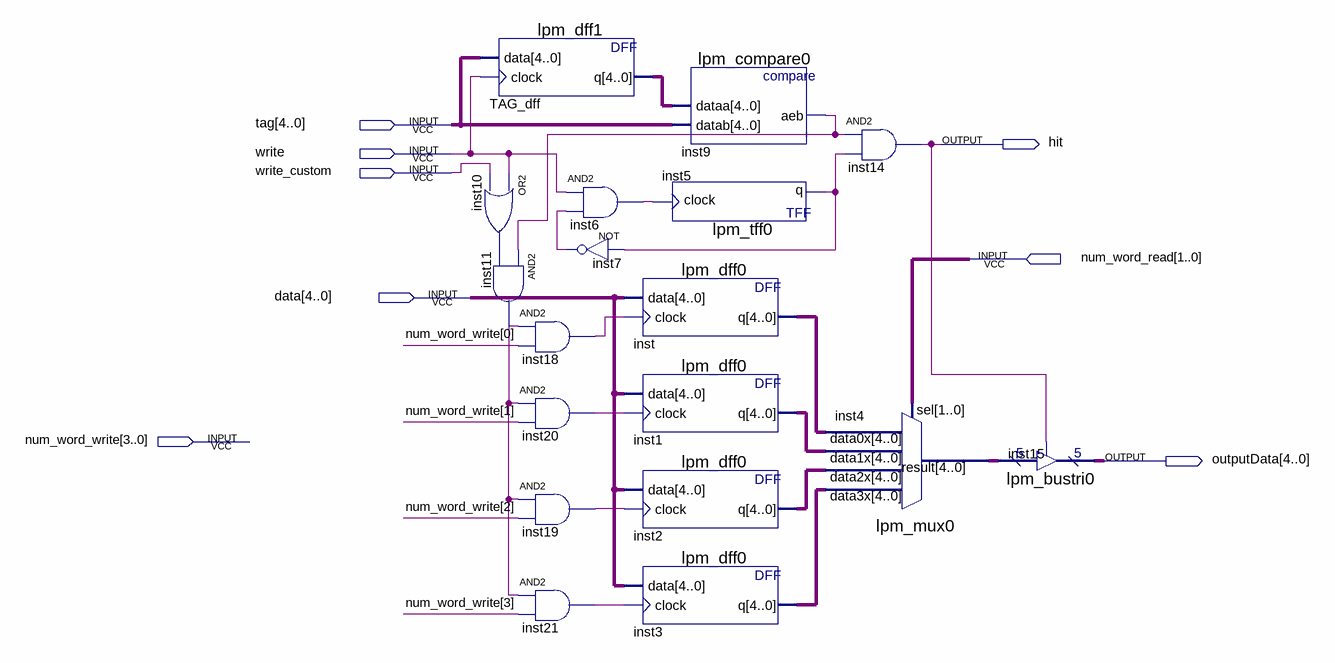
[diagram p0: schematic sheet]
// Quartus schematic String.bdf as structural Verilog: 18 symbols, 8 pins
module String (
  input  [4:0] tag,
  input  write,
  input  write_custom,
  input  [1:0] num_word_read,
  input  [4:0] data,
  input  [3:0] num_word_write,
  output hit,
  output [4:0] outputData
);

  wire inst5_q, inst6_out, inst7_out, inst9_aeb, inst10_out, inst11_out, inst18_out, inst19_out, inst20_out,
       inst21_out;
  wire [4:0] inst1_q, inst2_q, inst3_q, inst4_result, inst_q, TAG_dff_q;

  lpm_dff1 TAG_dff (.data(tag), .clock(write), .q(TAG_dff_q));
  or inst10 (inst10_out, write, write_custom);
  and inst11 (inst11_out, inst9_aeb, inst10_out);
  and inst18 (inst18_out, inst11_out, num_word_write[0]);
  and inst20 (inst20_out, inst11_out, num_word_write[1]);
  and inst19 (inst19_out, inst11_out, num_word_write[2]);
  and inst21 (inst21_out, inst11_out, num_word_write[3]);
  and inst6 (inst6_out, write, inst7_out);
  not inst7 (inst7_out, inst5_q);
  lpm_dff0 inst (.data(data), .clock(inst18_out), .q(inst_q));
  lpm_dff0 inst1 (.data(data), .clock(inst20_out), .q(inst1_q));
  lpm_dff0 inst2 (.data(data), .clock(inst19_out), .q(inst2_q));
  lpm_dff0 inst3 (.data(data), .clock(inst21_out), .q(inst3_q));
  lpm_compare0 inst9 (.dataa(TAG_dff_q), .datab(tag), .aeb(inst9_aeb));
  lpm_tff0 inst5 (.clock(inst6_out), .q(inst5_q));
  and inst14 (hit, inst9_aeb, inst5_q);
  lpm_mux0 inst4 (
    .data3x(inst3_q), .data2x(inst2_q), .data1x(inst1_q), .data0x(inst_q), .sel(num_word_read),
    .result(inst4_result));
  lpm_bustri0 inst15 (.enabledt(hit), .data(inst4_result), .tridata(outputData));
endmodule
